# Altium schematic sheet Sheet1.SchDoc
size A2
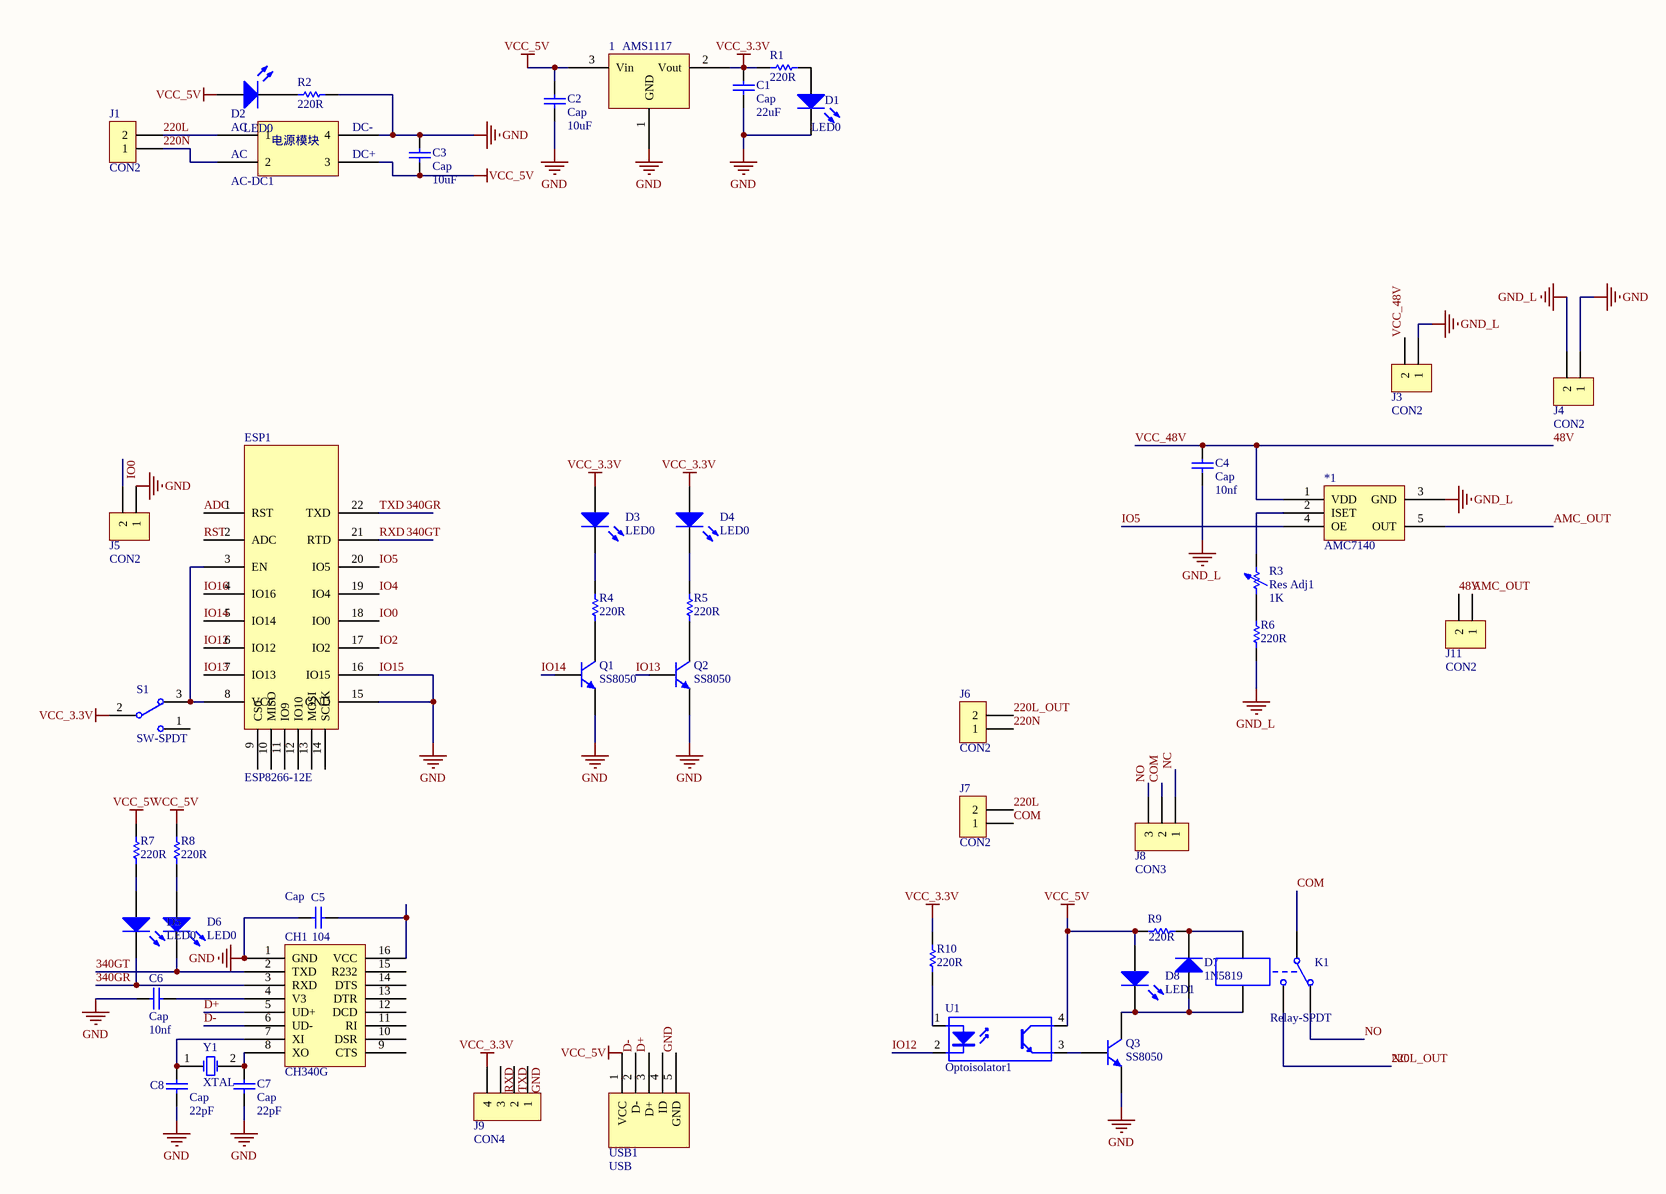
[diagram p0: Sheet1.SchDoc]

## Parts
1  AMS1117  [SOT223]
*1  AMC7140  [TO-252-5L]
AC-DC1  220—5  [POWER-220_5]  (value not drawn)
C1  Cap  value 22uF  [1206]
C2  Cap  value 10uF  [1206]
C3  Cap  value 10uF  [CAP-E SMD 8X8]
C4  Cap  value 10nf  [0805]
C5  Cap  value 104  [0805]
C6  Cap  value 10nf  [0805]
C7  Cap  value 22pF  [0805]
C8  Cap  value 22pF  [0805]
CH1  CH340G  [SOP16]
D1  LED0  [LED0805]
D2  LED0  [LED0805]
D3  LED0  [LED0805]
D4  LED0  [LED0805]
D5  LED0  [LED0805]
D6  LED0  [LED0805]
D7  1N5819  [DO-214AC/SMA]
D8  LED1  [LED0805]
ESP1  ESP8266-12E  [ESP8266]
J1  CON2  [TML-2-5.08]
J3  CON2  [TML-2-5.08]
J4  CON2  [HDR1X2]
J5  CON2  [HDR1X2]
J6  CON2  [TML-2-5.08]
J7  CON2  [HDR1X2]
J8  CON3  [TML-3-5.08]
J9  CON4  [SIP4]
J11  CON2  [TML-2-5.08]
K1  Relay-SPDT  [5V-5]
Q1  SS8050  [SOT-23]
Q2  SS8050  [SOT-23]
Q3  SS8050  [SOT-23]
R1  value 220R  [0805]  (hidden comment: Res)
R2  value 220R  [0805]  (hidden comment: Res)
R3  Res Adj1  value 1K  [RES ADJ-3296W]
R4  value 220R  [0805]  (hidden comment: Res)
R5  value 220R  [0805]  (hidden comment: Res)
R6  value 220R  [0805]  (hidden comment: Res)
R7  value 220R  [0805]  (hidden comment: Res)
R8  value 220R  [0805]  (hidden comment: Res)
R9  value 220R  [0805]  (hidden comment: Res)
R10  value 220R  [0805]  (hidden comment: Res)
S1  SW-SPDT  [SS12D00G3]
U1  Optoisolator1  [DIP4]
USB1  USB  [USB-MINI]
Y1  XTAL  [XTAL]

## Nets
GND: 1.1(GND) AC-DC1.4 C1.2 C2.2 C3.1 C5.2 C6.2 C7.1 C8.1 CH1.1(GND) D1.2(K) ESP1.15(GND) ESP1.16(IO15) J4.1 J5.1 J9.1 Q1.1(E) Q2.1(E) Q3.1(E) R2.1 USB1.5(GND)  [also labelled IO15]
GND_L: *1.3(GND) C4.2 J3.1 J4.2 R6.1
VCC_3.3V: 1.2(Vout) C1.1 D3.1(A) D4.1(A) J9.4 R1.2 R10.2 S1.2
VCC_5V: 1.3(Vin) AC-DC1.3 C2.1 C3.2 D2.1(A) D8.1(A) R7.2 R8.2 R9.1 U1.4(C) USB1.1(VCC)
48V: *1.1(VDD) C4.1 J3.2 J11.2  [also labelled VCC_48V]
220L: AC-DC1.1 J1.2 J7.2
220L_OUT: J6.2 J8.1 K1.3  [also labelled NC]
220N: AC-DC1.2 J1.1 J6.1
340GR: CH1.3(RXD) D5.2(K) ESP1.22(TXD) J9.2  [also labelled TXD]
340GT: CH1.2(TXD) D6.2(K) ESP1.21(RTD) J9.3  [also labelled RXD]
ADC: ESP1.1(RST)
AMC_OUT: *1.5(OUT) J11.1
COM: J7.1 J8.2 K1.1
D+: CH1.5(UD+) USB1.3(D+)
D-: CH1.6(UD-) USB1.2(D-)
IO0: ESP1.18(IO0) J5.2
IO2: ESP1.17(IO2)
IO4: ESP1.19(IO4)
IO5: *1.4(OE) ESP1.20(IO5)
IO12: ESP1.6(IO12) U1.2(K)
IO13: ESP1.7(IO13) Q2.2(B)
IO14: ESP1.5(IO14) Q1.2(B)
IO16: ESP1.4(IO16)
NO: J8.3 K1.2
RST: ESP1.2(ADC)
Net*1_2: *1.2(ISET) R3.2
NetC5_1: C5.1 CH1.16(VCC)
NetC6_1: C6.1 CH1.4(V3)
NetC7_2: C7.2 CH1.8(XO) Y1.2(OSC2)
NetC8_2: C8.2 CH1.7(XI) Y1.1(OSC1)
NetD1_1: D1.1(A) R1.1
NetD2_2: D2.2(K) R2.2
NetD3_2: D3.2(K) R4.2
NetD4_2: D4.2(K) R5.2
NetD5_1: D5.1(A) R7.1
NetD6_1: D6.1(A) R8.1
NetD7_1: D7.1(A) D8.2(K) K1.5 Q3.3(C)
NetD7_2: D7.2(K) K1.4 R9.2
NetESP1_3: ESP1.3(EN) ESP1.8(VCC) S1.3
NetQ1_3: Q1.3(C) R4.1
NetQ2_3: Q2.3(C) R5.1
NetQ3_2: Q3.2(B) U1.3(E)
NetR3_1: R3.1 R6.2
NetR10_1: R10.1 U1.1(A)

Not connected (* = marked no-connect by the designer): CH1 9(CTS) 10(DSR) 11(RI) 12(DCD) 13(DTR) 14(DTS) 15(R232); ESP1 9(CS0) 10(MISO) 11(IO9) 12(IO10) 13(MOSI) 14(SCLK); S1 1; USB1 4(ID)

## Notes on the sheet
- (in symbol 220—5) AC; DC-; 电源模块; DC+

## Library data of the parts
AC-DC1 = 220—5: pin to pad: 1>2 2>1
C1-C8 = Cap: Capacitor; Published: 8-Jun-2000; LatestRevisionDate: 17-Jul-2002; LatestRevisionNote: Re-released for DXP Platform.; PackageReference: RAD-0.3; Publisher: Altium Limited
D1-D6 = LED0: Typical INFRARED GaAs LED; Published: 8-Jun-2000; LatestRevisionDate: 08-Jul-2005; LatestRevisionNote: Mech Layer 1 removed.; PackageReference: LED-0; Publisher: Altium Limited; PackageDescription: LED; 2 Leads
D7 = Diode: Default Diode; Published: 8-Jun-2000; LatestRevisionDate: 17-Jul-2002; LatestRevisionNote: Re-released for DXP Platform.; PackageVersion: Sep-1996; PackageReference: SMC; Publisher: Altium Limited; PackageDescription: DO-214-AB/SMC; 2 C-Bend Leads; Body 7.9 x 5.9 mm, inc. leads (LxW); Code_JEDEC: DO-214-AB
D8 = LED1: Typical RED GaAs LED; Published: 8-Jun-2000; LatestRevisionDate: 08-Jul-2005; LatestRevisionNote: Mech Layer 1 removed.; PackageReference: LED-1; Publisher: Altium Limited; PackageDescription: LED; 2 Leads
ESP1 = ESP8266
J1 J11 = CON2: Connector; pin to pad: 1>2 2>1
J3-J7 = CON2: Connector
J8 = CON3: Connector; pin to pad: 1>3 3>1
J9 = CON4: Connector
K1 = Relay-SPDT: Single-Pole Dual-Throw Relay; pin to pad: 2>4 3>5 4>3 5>2; Published: 24-Mar-1999; LatestRevisionDate: 17-Jul-2002; LatestRevisionNote: Re-released for DXP Platform.; PackageReference: MODULE5B; Publisher: Altium Limited
Q1-Q3 = 2N3904: NPN General Purpose Amplifier; pin to pad: 1>2 2>1; Published: 8-Jun-2000; LatestRevisionDate: 15-Jan-2003; LatestRevisionNote: PCB Footprint 'BCY-W3/D4.7' replaced; DatasheetVersion: 1997; PackageVersion: Sep-1998; PackageReference: TO-92A; Publisher: Altium Limited; ComponentLink1Description: Manufacturer Link; ComponentLink1URL: http://www.fairchildsemi.com/; ComponentLink2Description: Datasheet; ComponentLink2URL: http://www.fairchildsemi.com/ds/2N%2F2N3904.pdf; PackageDescription: TO, Flat Index; 3 In-Line, Axial Leads; Body Dia. 4.5mm; Leads 0.51 x 0.48 mm (max)
R1 R2 R4-R10 = Res: Resistor; Published: 8-Jun-2000; LatestRevisionDate: 17-Jul-2002; LatestRevisionNote: Re-released for DXP Platform.; PackageReference: AXIAL-0.3; Publisher: Altium Limited; PackageDescription: Axial Device, Thru-Hole; 2 Leads; 0.3 in Pin Spacing
R3 = Res Adj1: Variable Resistor; Set Position: 0.5; Published: 8-Jun-2000; LatestRevisionDate: 17-Jul-2002; LatestRevisionNote: Re-released for DXP Platform.; PackageReference: AXIAL-0.7; Publisher: Altium Limited; PackageDescription: Axial Device, Thru-Hole; 2 Leads; 0.7 in Pin Spacing
S1 = SW-SPDT: SPDT Subminiature Toggle Switch, Right Angle Mounting, Vertical Actuation; Published: 24-Mar-1999; LatestRevisionDate: 17-Dec-2003; LatestRevisionNote: Schematic revised, PCB Footprint replaced.; DatasheetVersion: 05-Dec-2000; PackageReference: TL36WW15050; Publisher: Altium Limited; PackageDescription: Switch; 4 Leads; ComponentLink1Description: Manufacturer Link; ComponentLink1URL: http://www.apem.com
U1 = Optoisolator1: 4-Pin Phototransistor Optocoupler; Published: 24-Mar-1999; LatestRevisionDate: 04-Mar-2005; LatestRevisionNote: Sch pins 3 & 4 Swapped.; DatasheetVersion: Nov-2003; PackageReference: DIP-4; Publisher: Altium Limited
USB1 = miniUSB-b
Y1 = XTAL: Crystal Oscillator; Published: 8-Jun-2000; LatestRevisionDate: 17-Jul-2002; LatestRevisionNote: Re-released for DXP Platform.; PackageReference: R38; Publisher: Altium Limited